# EAGLE schematic BusPirate-ultra.v1.0b (EAGLE 9.1.3)
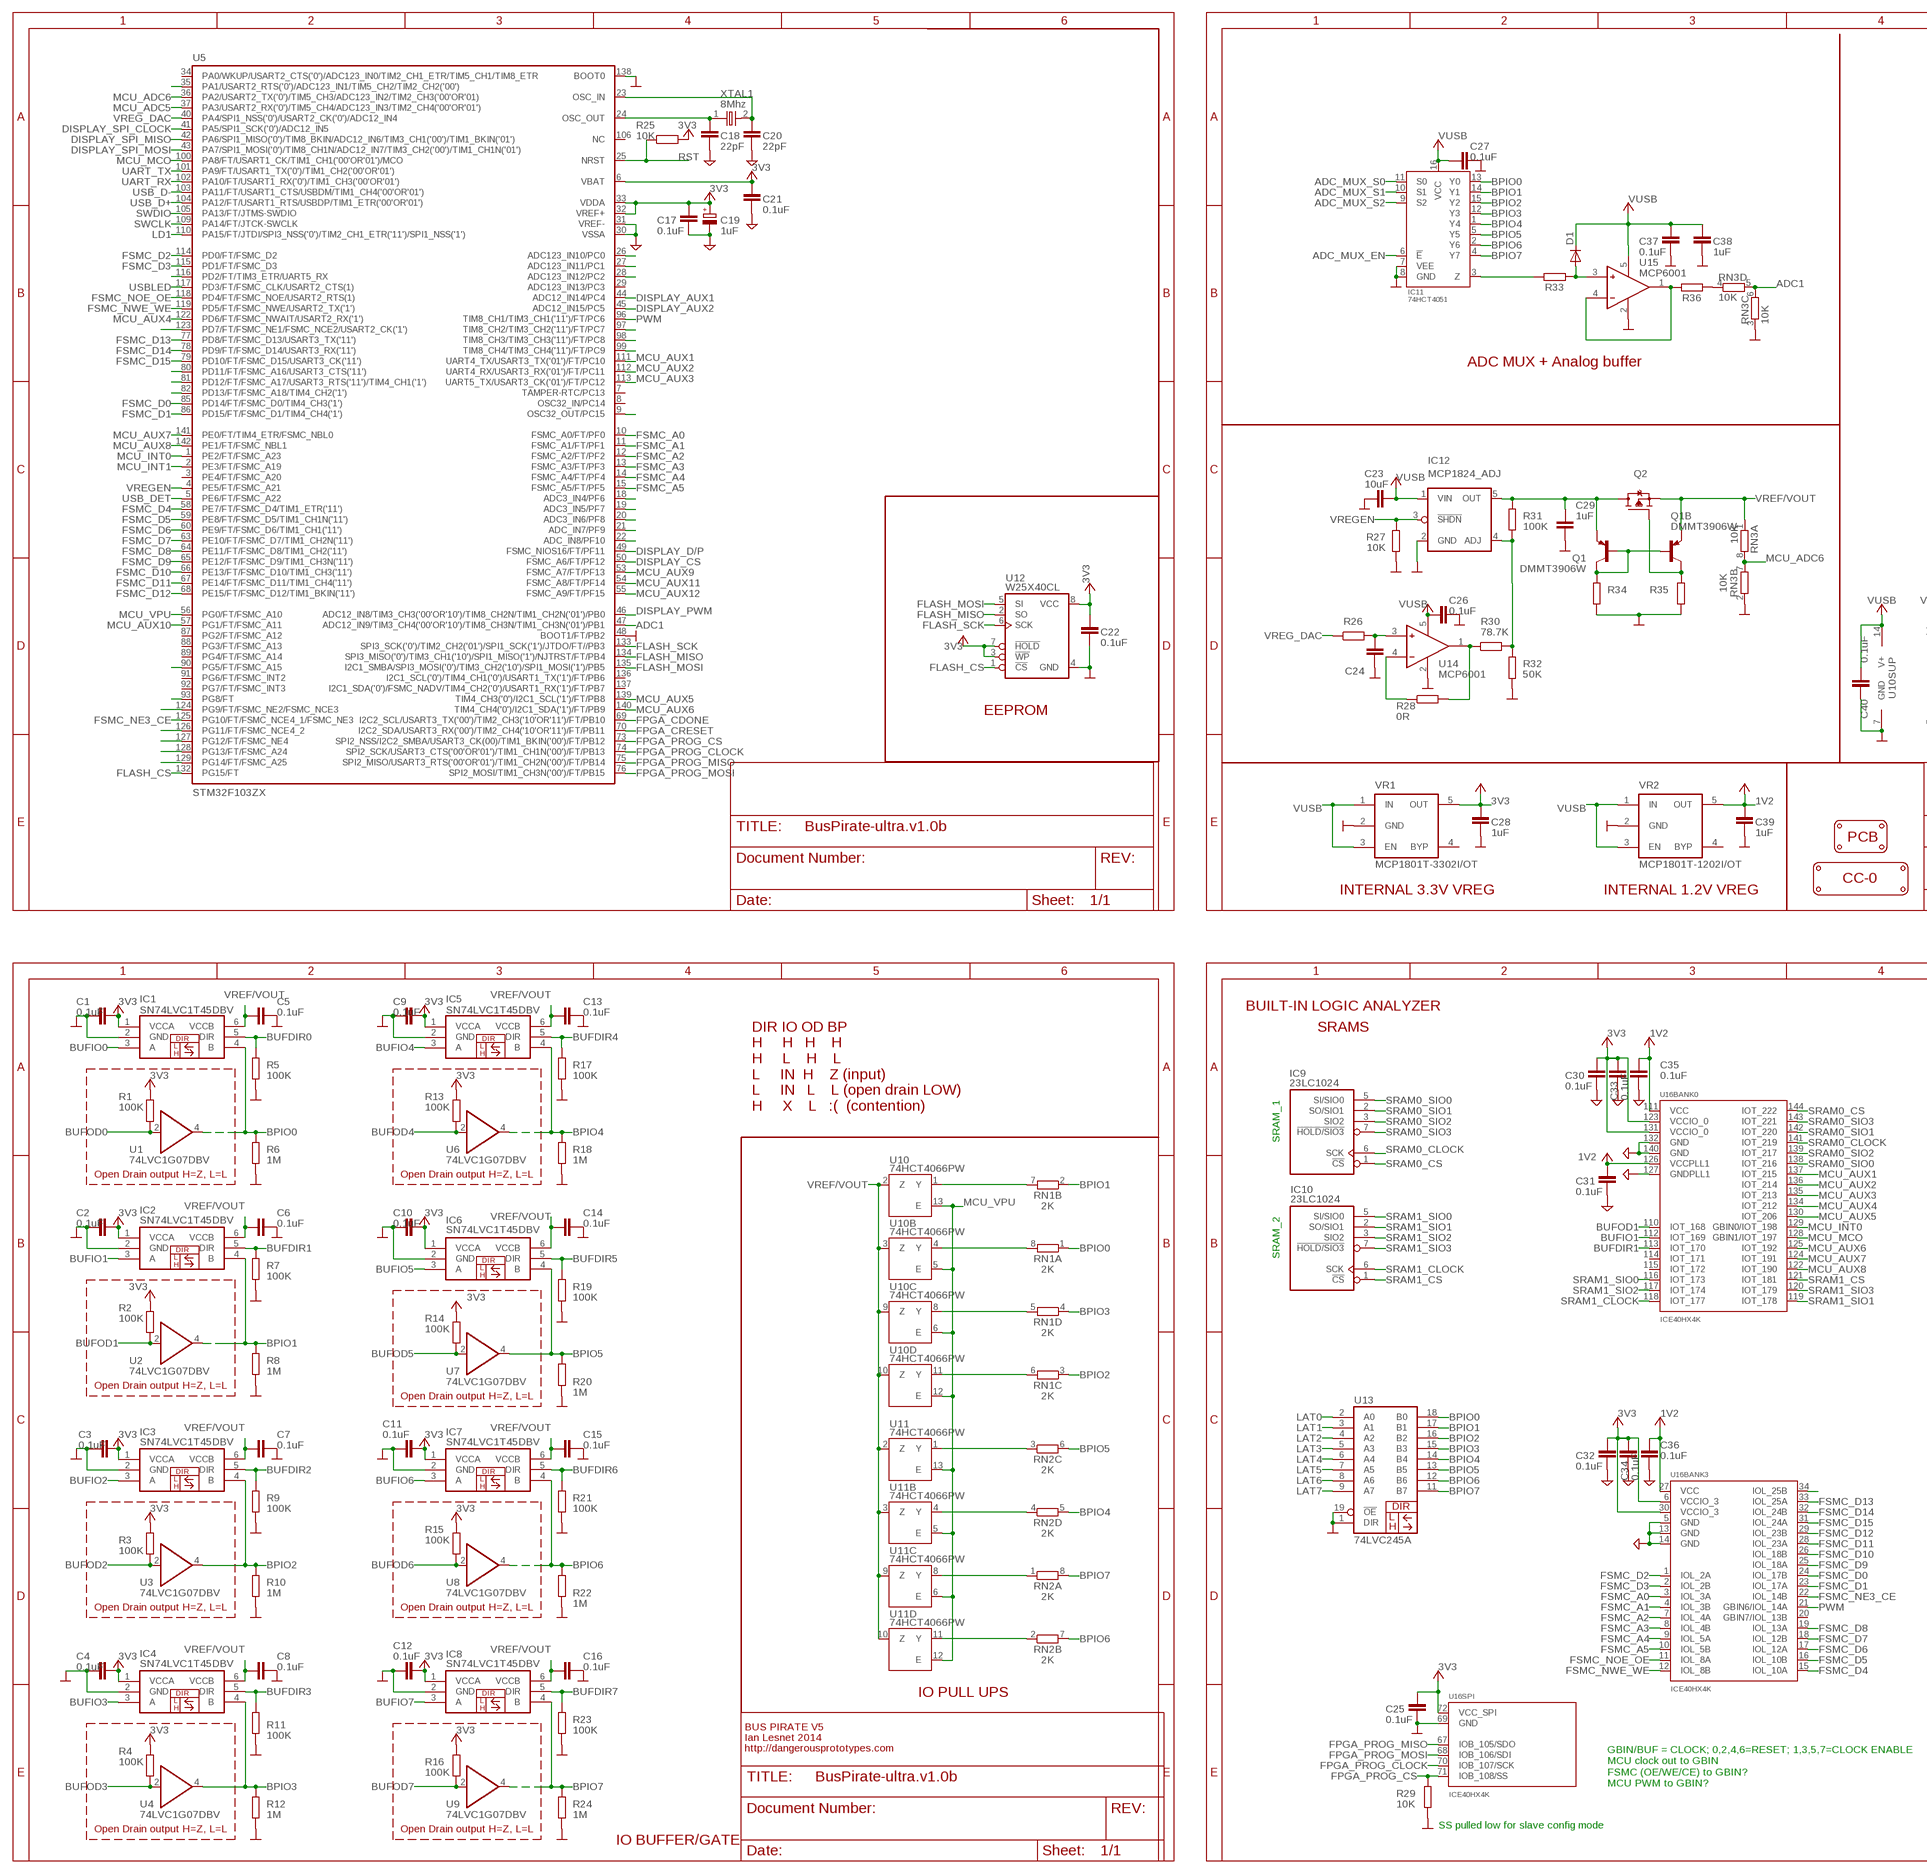
[diagram p0: schematic, sheet 1, part 1 of 2]
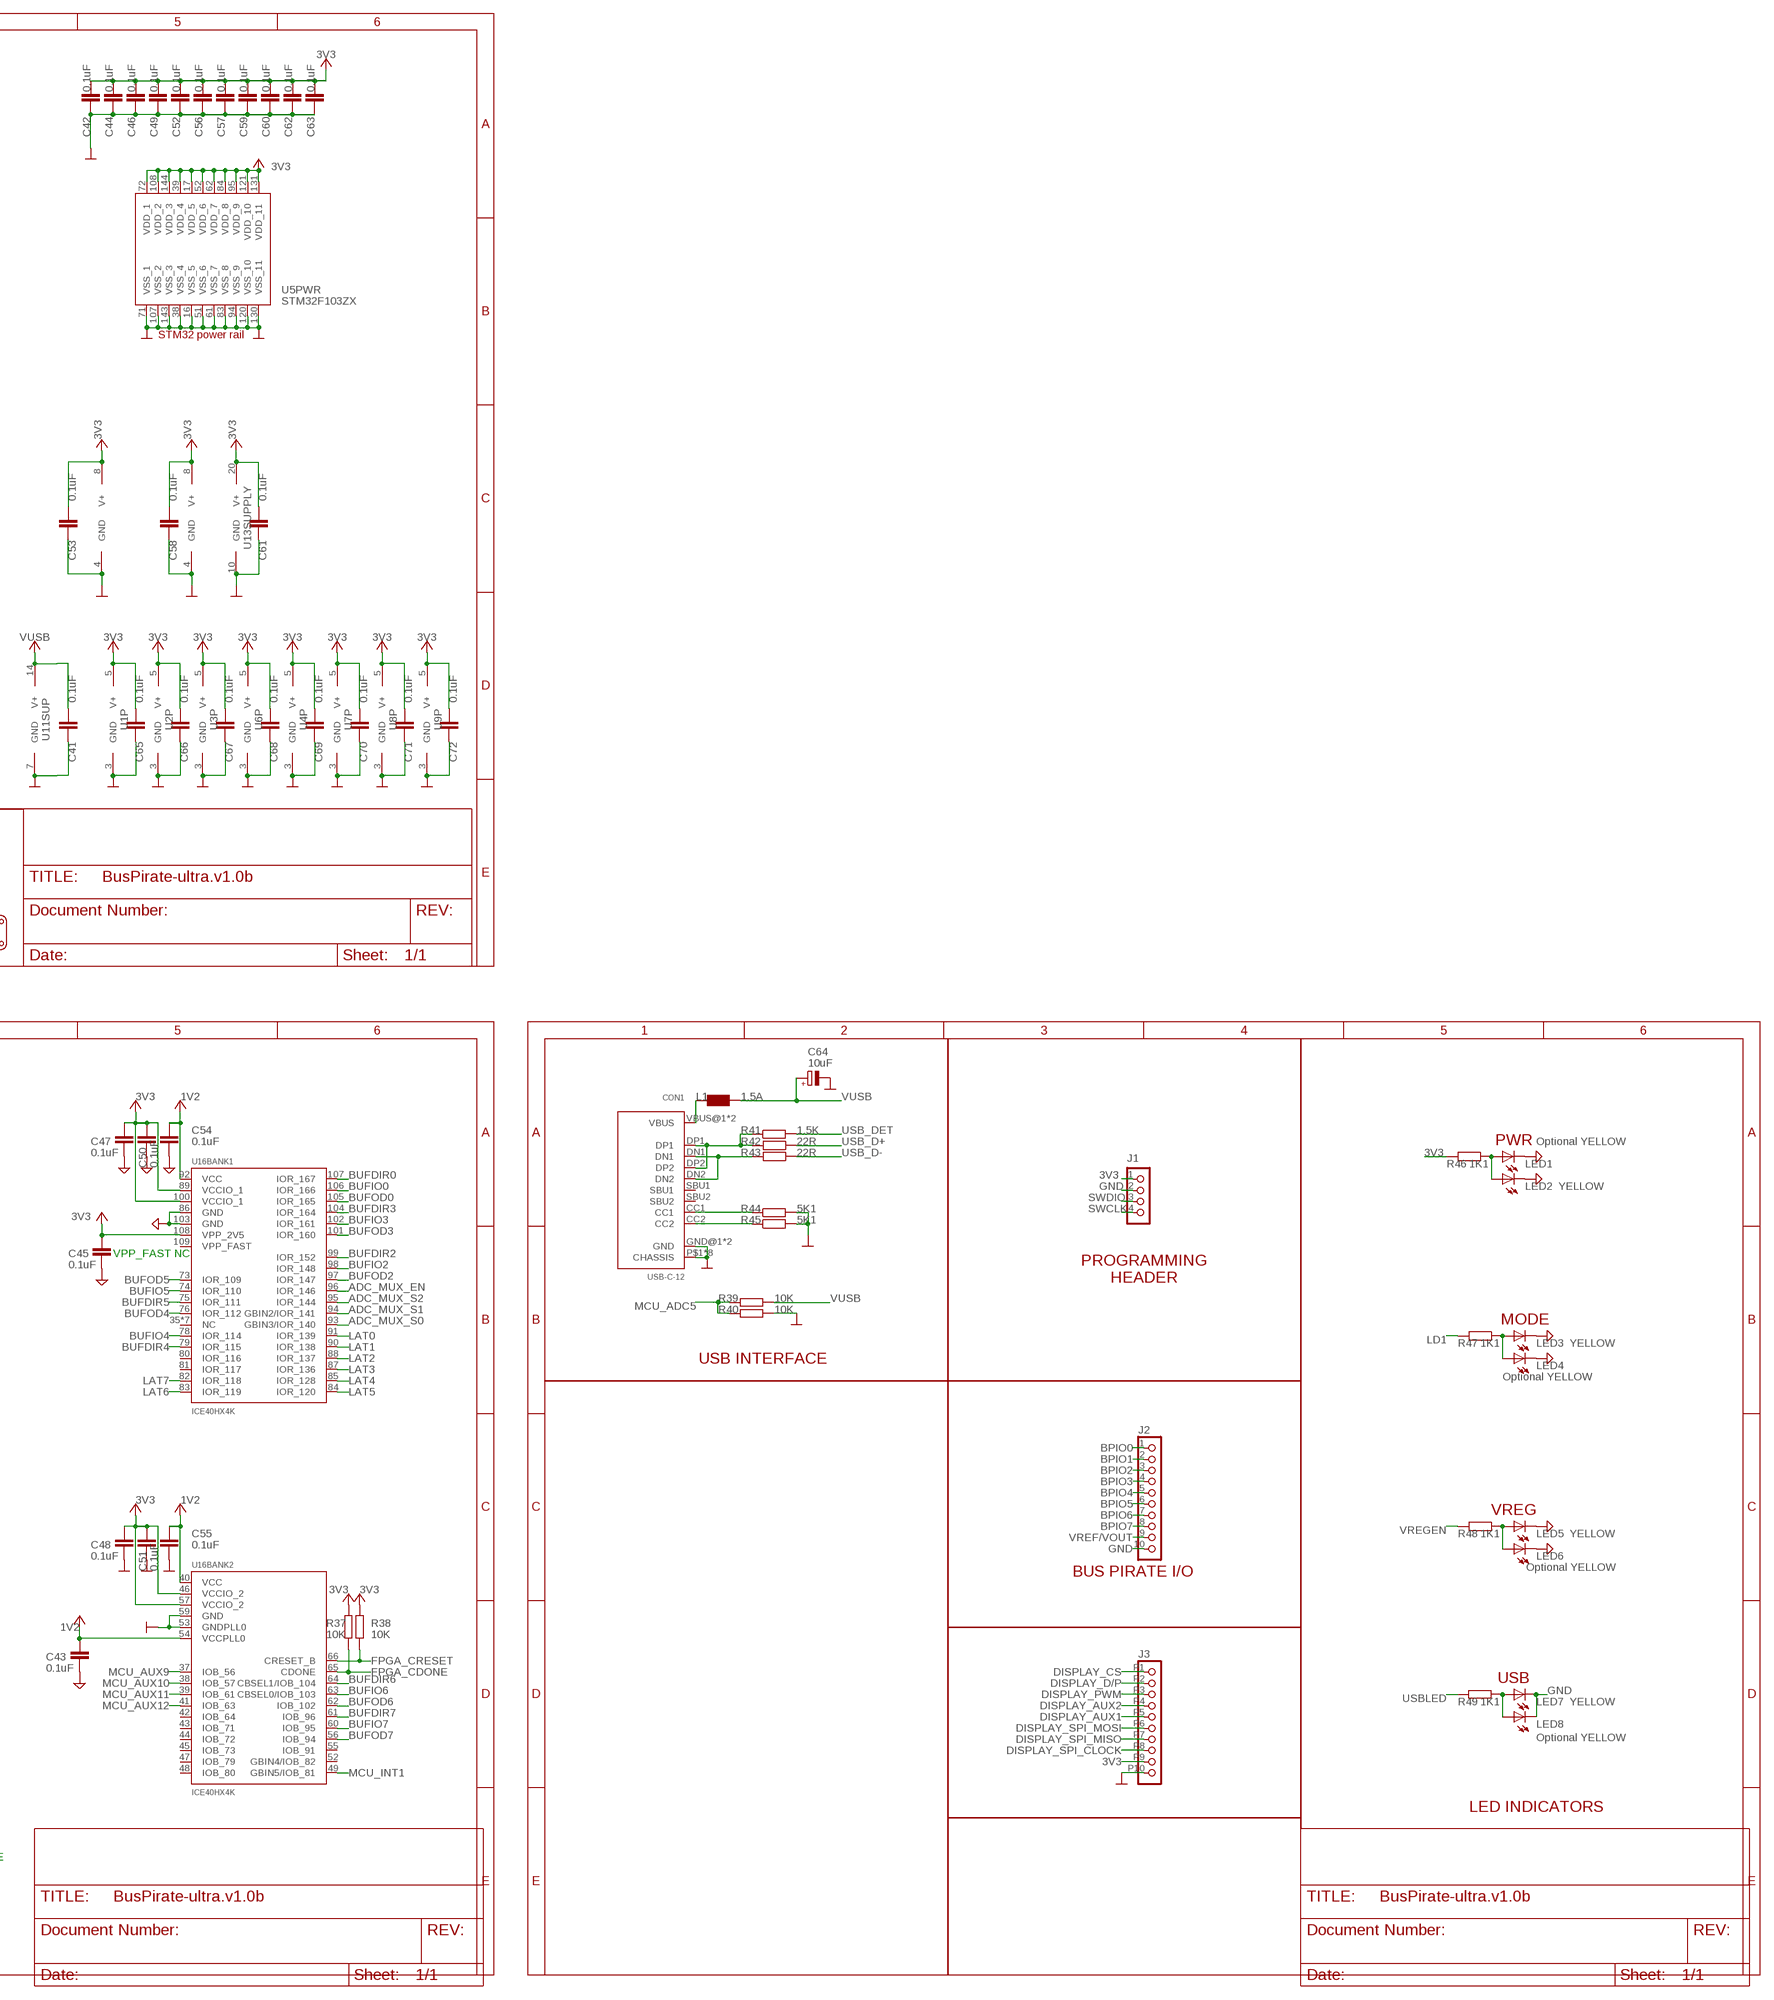
[diagram p1: schematic, sheet 1, part 2 of 2]

## Parts
C1  0.1uF  CAPACITOR_NPOL-0402  [C402]
C2  0.1uF  CAPACITOR_NPOL-0402  [C402]
C3  0.1uF  CAPACITOR_NPOL-0402  [C402]
C4  0.1uF  CAPACITOR_NPOL-0402  [C402]
C5  0.1uF  CAPACITOR_NPOL-0402  [C402]
C6  0.1uF  CAPACITOR_NPOL-0402  [C402]
C7  0.1uF  CAPACITOR_NPOL-0402  [C402]
C8  0.1uF  CAPACITOR_NPOL-0402  [C402]
C9  0.1uF  CAPACITOR_NPOL-0402  [C402]
C10  0.1uF  CAPACITOR_NPOL-0402  [C402]
C11  0.1uF  CAPACITOR_NPOL-0402  [C402]
C12  0.1uF  CAPACITOR_NPOL-0402  [C402]
C13  0.1uF  CAPACITOR_NPOL-0402  [C402]
C14  0.1uF  CAPACITOR_NPOL-0402  [C402]
C15  0.1uF  CAPACITOR_NPOL-0402  [C402]
C16  0.1uF  CAPACITOR_NPOL-0402  [C402]
C17  0.1uF  CAPACITOR_NPOL-0603  [C603]
C18  22pF  CAPACITOR_NPOL-0603  [C603]
C19  1uF  CAPACITOR_POL-SMC_A  [SMC_A]
C20  22pF  CAPACITOR_NPOL-0603  [C603]
C21  0.1uF  CAPACITOR_NPOL-0603  [C603]
C22  0.1uF  CAPACITOR_NPOL-0603  [C603]
C23  10uF  CAPACITOR_NPOL-0603  [C603]
C24  CAPACITOR_NPOL-0603  [C603]
C25  0.1uF  CAPACITOR_NPOL-0603  [C603]
C26  0.1uF  CAPACITOR_NPOL-0603  [C603]
C27  0.1uF  CAPACITOR_NPOL-0603  [C603]
C28  1uF  CAPACITOR_NPOL-0603  [C603]
C29  1uF  CAPACITOR_NPOL-0603  [C603]
C30  0.1uF  CAPACITOR_NPOL-0603  [C603]
C31  0.1uF  CAPACITOR_NPOL-0603  [C603]
C32  0.1uF  CAPACITOR_NPOL-0402  [C402]
C33  0.1uF  CAPACITOR_NPOL-0603  [C603]
C34  0.1uF  CAPACITOR_NPOL-0603  [C603]
C35  0.1uF  CAPACITOR_NPOL-0603  [C603]
C36  0.1uF  CAPACITOR_NPOL-0402  [C402]
C37  0.1uF  CAPACITOR_NPOL-0603  [C603]
C38  1uF  CAPACITOR_NPOL-0603  [C603]
C39  1uF  CAPACITOR_NPOL-0603  [C603]
C40  0.1uF  CAPACITOR_NPOL-0603  [C603]
C41  0.1uF  CAPACITOR_NPOL-0603  [C603]
C42  0.1uF  CAPACITOR_NPOL-0603  [C603]
C43  0.1uF  CAPACITOR_NPOL-0603  [C603]
C44  0.1uF  CAPACITOR_NPOL-0603  [C603]
C45  0.1uF  CAPACITOR_NPOL-0603  [C603]
C46  0.1uF  CAPACITOR_NPOL-0603  [C603]
C47  0.1uF  CAPACITOR_NPOL-0603  [C603]
C48  0.1uF  CAPACITOR_NPOL-0603  [C603]
C49  0.1uF  CAPACITOR_NPOL-0603  [C603]
C50  0.1uF  CAPACITOR_NPOL-0603  [C603]
C51  0.1uF  CAPACITOR_NPOL-0603  [C603]
C52  0.1uF  CAPACITOR_NPOL-0603  [C603]
C53  0.1uF  CAPACITOR_NPOL-0603  [C603]
C54  0.1uF  CAPACITOR_NPOL-0603  [C603]
C55  0.1uF  CAPACITOR_NPOL-0603  [C603]
C56  0.1uF  CAPACITOR_NPOL-0603  [C603]
C57  0.1uF  CAPACITOR_NPOL-0603  [C603]
C58  0.1uF  CAPACITOR_NPOL-0603  [C603]
C59  0.1uF  CAPACITOR_NPOL-0402  [C402]
C60  0.1uF  CAPACITOR_NPOL-0603  [C603]
C61  0.1uF  CAPACITOR_NPOL-0603  [C603]
C62  0.1uF  CAPACITOR_NPOL-0603  [C603]
C63  0.1uF  CAPACITOR_NPOL-0603  [C603]
C64  10uF  CAPACITOR_POL-SMC_A  [SMC_A]
C65  0.1uF  CAPACITOR_NPOL-0402  [C402]
C66  0.1uF  CAPACITOR_NPOL-0402  [C402]
C67  0.1uF  CAPACITOR_NPOL-0402  [C402]
C68  0.1uF  CAPACITOR_NPOL-0402  [C402]
C69  0.1uF  CAPACITOR_NPOL-0402  [C402]
C70  0.1uF  CAPACITOR_NPOL-0402  [C402]
C71  0.1uF  CAPACITOR_NPOL-0402  [C402]
C72  0.1uF  CAPACITOR_NPOL-0402  [C402]
CON1  USB-C-12  [C-31-M-12]
D1  DIODE-SOD-123  [SOD-123]
IC1  SN74LVC1T45DBV  IC_BUFF_SN74LVC1T45DBV-SC-70-6  [SC-70-6]
IC2  SN74LVC1T45DBV  IC_BUFF_SN74LVC1T45DBV-SC-70-6  [SC-70-6]
IC3  SN74LVC1T45DBV  IC_BUFF_SN74LVC1T45DBV-SC-70-6  [SC-70-6]
IC4  SN74LVC1T45DBV  IC_BUFF_SN74LVC1T45DBV-SC-70-6  [SC-70-6]
IC5  SN74LVC1T45DBV  IC_BUFF_SN74LVC1T45DBV-SC-70-6  [SC-70-6]
IC6  SN74LVC1T45DBV  IC_BUFF_SN74LVC1T45DBV-SC-70-6  [SC-70-6]
IC7  SN74LVC1T45DBV  IC_BUFF_SN74LVC1T45DBV-SC-70-6  [SC-70-6]
IC8  SN74LVC1T45DBV  IC_BUFF_SN74LVC1T45DBV-SC-70-6  [SC-70-6]
IC9  23LC1024  IC_MEM_23LC1024  [SOIC-8]
IC10  23LC1024  IC_MEM_23LC1024  [SOIC-8]
IC11  74HCT4051  IC_74HCT4051  [TSSOP-16]
IC12  MCP1824_ADJ  IC_MCP1824_ADJ  [SOT-23-5]
J1  CON_HEADER_1X04  [M1X4]
J2  CON_HEADER_1X10-RIGHT_ANGLED_PTH_SHROUDED  [M1X10_MALE_RIGHT_ANGLES_PTH_SHROUDED]
J3  CON_MOLEX_MALE_SMT_SH_1.25  [MOLEX_533980771]
L1  1.5A  WE-KIL_0805  [WE-KI_0805_B]
LED1  Optional YELLOW  LED-0805  [LED-805]
LED2  YELLOW  LED-0805  [LED-805]
LED3  YELLOW  LED-0805  [LED-805]
LED4  Optional YELLOW  LED-0805  [LED-805]
LED5  YELLOW  LED-0805  [LED-805]
LED6  Optional YELLOW  LED-0805  [LED-805]
LED7  YELLOW  LED-0805  [LED-805]
LED8  Optional YELLOW  LED-0805  [LED-805]
LOGO1  LOGO_CC-0  [LOGO_CC-0]
PCB1  PCB_DP_RECTANGLE-50X100  [DP10050_V1]
Q1  DMMT3906W  TRANSISTOR-BJT_DMMT3906W  [SOT-363]
Q2  TRANSISTOR_FET_TSM2301CX  [SOT-23]
R1  100K  RESISTOR-0402  [R402]
R2  100K  RESISTOR-0402  [R402]
R3  100K  RESISTOR-0402  [R402]
R4  100K  RESISTOR-0402  [R402]
R5  100K  RESISTOR-0402  [R402]
R6  1M  RESISTOR-0402  [R402]
R7  100K  RESISTOR-0402  [R402]
R8  1M  RESISTOR-0402  [R402]
R9  100K  RESISTOR-0402  [R402]
R10  1M  RESISTOR-0402  [R402]
R11  100K  RESISTOR-0402  [R402]
R12  1M  RESISTOR-0402  [R402]
R13  100K  RESISTOR-0402  [R402]
R14  100K  RESISTOR-0402  [R402]
R15  100K  RESISTOR-0402  [R402]
R16  100K  RESISTOR-0402  [R402]
R17  100K  RESISTOR-0402  [R402]
R18  1M  RESISTOR-0402  [R402]
R19  100K  RESISTOR-0402  [R402]
R20  1M  RESISTOR-0402  [R402]
R21  100K  RESISTOR-0402  [R402]
R22  1M  RESISTOR-0402  [R402]
R23  100K  RESISTOR-0402  [R402]
R24  1M  RESISTOR-0402  [R402]
R25  10K  RESISTOR-0603  [R603]
R26  RESISTOR-0603  [R603]
R27  10K  RESISTOR-0603  [R603]
R28  0R  RESISTOR-0603  [R603]
R29  10K  RESISTOR-0603  [R603]
R30  78.7K  RESISTOR-0603  [R603]
R31  100K  RESISTOR-0603  [R603]
R32  50K  RESISTOR-0603  [R603]
R33  RESISTOR-0603  [R603]
R34  RESISTOR-0603  [R603]
R35  RESISTOR-0603  [R603]
R36  RESISTOR-0603  [R603]
R37  10K  RESISTOR-0603  [R603]
R38  10K  RESISTOR-0603  [R603]
R39  10K  RESISTOR-0603  [R603]
R40  10K  RESISTOR-0603  [R603]
R41  1.5K  RESISTOR-0603  [R603]
R42  22R  RESISTOR-0603  [R603]
R43  22R  RESISTOR-0603  [R603]
R44  5K1  RESISTOR-0603  [R603]
R45  5K1  RESISTOR-0603  [R603]
R46  1K1  RESISTOR-0603  [R603]
R47  1K1  RESISTOR-0603  [R603]
R48  1K1  RESISTOR-0603  [R603]
R49  1K1  RESISTOR-0603  [R603]
RN1  2K  RNETWORK  [RN8P-4R-CRA06S]
RN2  2K  RNETWORK  [RN8P-4R-CRA06S]
RN3  10K  RNETWORK  [RN8P-4R-CRA06S]
U1  74LVC1G07DBV  IC_BUFF_74LVC1G07  [SC-70-5]
U2  74LVC1G07DBV  IC_BUFF_74LVC1G07  [SC-70-5]
U3  74LVC1G07DBV  IC_BUFF_74LVC1G07  [SC-70-5]
U4  74LVC1G07DBV  IC_BUFF_74LVC1G07  [SC-70-5]
U5  STM32F103ZX  IC_UC_STM32F103ZX  [TQFP-144]
U6  74LVC1G07DBV  IC_BUFF_74LVC1G07  [SC-70-5]
U7  74LVC1G07DBV  IC_BUFF_74LVC1G07  [SC-70-5]
U8  74LVC1G07DBV  IC_BUFF_74LVC1G07  [SC-70-5]
U9  74LVC1G07DBV  IC_BUFF_74LVC1G07  [SC-70-5]
U10  74HCT4066PW  IC_74HCT4066PW  [TSSOP-14]
U11  74HCT4066PW  IC_74HCT4066PW  [TSSOP-14]
U12  W25X40CL  IC_MEM_W25X40CL  [SOIC-8]
U13  74LVC245A  IC_BUFF_74LVC245A-TSSOP20  [TSSOP-20]
U14  MCP6001  IC_OP-AMP_MCP6001  [SOT-23-5]
U15  MCP6001  IC_MCP6001  [SOT-23-5]
U16  ICE40HX4K  IC_FPGA_ICE40HX4K  [TQFP-144]
VR1  MCP1801T-3302I/OT  MIC5205  [SOT-23-5@1]
VR2  MCP1801T-1202I/OT  MIC5205  [SOT-23-5@1]
XTAL1  8Mhz  OSC-XTAL-12M  [XTAL_4X6]

## Nets
1V2: C31.1 C35.1 C36.1 C39.2 C43.1 C54.1 C55.1 U16.27(BANK3:VCC) U16.40(BANK2:VCC) U16.54(BANK2:VCCPLL0) U16.92(BANK1:VCC) U16.111(BANK0:VCC) U16.126(BANK0:VCCPLL1) VR2.5(OUT) ; supply symbol labelled SUPPLY_+3V3
3V3: C1.2 C2.2 C3.2 C4.2 C9.2 C10.2 C11.2 C12.2 C17.1 C19.+ C21.1 C22.1 C25.1 C28.2 C30.1 C32.1 C33.1 C34.1 C42.1 C44.1 C45.1 C46.1 C47.1 C48.1 C49.1 C50.1 C51.1 C52.1 C53.2 C56.1 C57.1 C58.2 C59.1 C60.1 C61.2 C62.1 C63.1 C65.2 C66.2 C67.2 C68.2 C69.2 C70.2 C71.2 C72.2 IC1.1(VCCA) IC2.1(VCCA) IC3.1(VCCA) IC4.1(VCCA) IC5.1(VCCA) IC6.1(VCCA) IC7.1(VCCA) IC8.1(VCCA) IC9.8(V+) IC10.8(V+) J1.1 J3.P9 R1.2 R2.2 R3.2 R4.2 R13.2 R14.2 R15.2 R16.2 R25.2 R37.2 R38.2 R46.2 U1.5(V+) U2.5(V+) U3.5(V+) U4.5(V+) U5.6(VBAT) U5.17(VDD_5) U5.32(VREF+) U5.33(VDDA) U5.39(VDD_4) U5.52(VDD_6) U5.62(VDD_7) U5.72(VDD_1) U5.84(VDD_8) U5.95(VDD_9) U5.108(VDD_2) U5.121(VDD_10) U5.131(VDD_11) U5.144(VDD_3) U6.5(V+) U7.5(V+) U8.5(V+) U9.5(V+) U12.3(!WP) U12.7(!HOLD) U12.8(VCC) U13.20(V+) U16.6(BANK3:VCCIO_3) U16.30(BANK3:VCCIO_3) U16.46(BANK2:VCCIO_2) U16.57(BANK2:VCCIO_2) U16.72(SPI:VCC_SPI) U16.89(BANK1:VCCIO_1) U16.100(BANK1:VCCIO_1) U16.108(BANK1:VPP_2V5) U16.123(BANK0:VCCIO_0) U16.131(BANK0:VCCIO_0) VR1.5(OUT) ; supply symbol labelled V+, SUPPLY_+3V3, VCC
ADC1: RN3.5 RN3.6 U5.47(ADC12_IN9/TIM3_CH4('00'OR'10')/TIM8_CH3N/TIM1_CH3N('01')/PB1)
ADC_MUX_EN: IC11.6(!E) U16.96(BANK1:IOR_146)
ADC_MUX_S0: IC11.11(S0) U16.93(BANK1:GBIN3/IOR_140)
ADC_MUX_S1: IC11.10(S1) U16.94(BANK1:GBIN2/IOR_141)
ADC_MUX_S2: IC11.9(S2) U16.95(BANK1:IOR_144)
BPIO0: IC1.4(B) IC11.13(Y0) J2.1 R6.2 RN1.1 U1.4(O) U13.18(B0)
BPIO1: IC2.4(B) IC11.14(Y1) J2.2 R8.2 RN1.2 U2.4(O) U13.17(B1)
BPIO2: IC3.4(B) IC11.15(Y2) J2.3 R10.2 RN1.3 U3.4(O) U13.16(B2)
BPIO3: IC4.4(B) IC11.12(Y3) J2.4 R12.2 RN1.4 U4.4(O) U13.15(B3)
BPIO4: IC5.4(B) IC11.1(Y4) J2.5 R18.2 RN2.5 U6.4(O) U13.14(B4)
BPIO5: IC6.4(B) IC11.5(Y5) J2.6 R20.2 RN2.6 U7.4(O) U13.13(B5)
BPIO6: IC7.4(B) IC11.2(Y6) J2.7 R22.2 RN2.7 U8.4(O) U13.12(B6)
BPIO7: IC8.4(B) IC11.4(Y7) J2.8 R24.2 RN2.8 U9.4(O) U13.11(B7)
BUFDIR0: IC1.5(DIR) R5.2 U16.107(BANK1:IOR_167)
BUFDIR1: IC2.5(DIR) R7.2 U16.113(BANK0:IOT_170)
BUFDIR2: IC3.5(DIR) R9.2 U16.99(BANK1:IOR_152)
BUFDIR3: IC4.5(DIR) R11.2 U16.104(BANK1:IOR_164)
BUFDIR4: IC5.5(DIR) R17.2 U16.79(BANK1:IOR_115)
BUFDIR5: IC6.5(DIR) R19.2 U16.75(BANK1:IOR_111)
BUFDIR6: IC7.5(DIR) R21.2 U16.64(BANK2:CBSEL1/IOB_104)
BUFDIR7: IC8.5(DIR) R23.2 U16.61(BANK2:IOB_96)
BUFIO0: IC1.3(A) U16.106(BANK1:IOR_166)
BUFIO1: IC2.3(A) U16.112(BANK0:IOT_169)
BUFIO2: IC3.3(A) U16.98(BANK1:IOR_148)
BUFIO3: IC4.3(A) U16.102(BANK1:IOR_161)
BUFIO4: IC5.3(A) U16.78(BANK1:IOR_114)
BUFIO5: IC6.3(A) U16.74(BANK1:IOR_110)
BUFIO6: IC7.3(A) U16.63(BANK2:CBSEL0/IOB_103)
BUFIO7: IC8.3(A) U16.60(BANK2:IOB_95)
BUFOD0: R1.1 U1.2(I) U16.105(BANK1:IOR_165)
BUFOD1: R2.1 U2.2(I) U16.110(BANK0:IOT_168)
BUFOD2: R3.1 U3.2(I) U16.97(BANK1:IOR_147)
BUFOD3: R4.1 U4.2(I) U16.101(BANK1:IOR_160)
BUFOD4: R13.1 U6.2(I) U16.76(BANK1:IOR_112)
BUFOD5: R14.1 U7.2(I) U16.73(BANK1:IOR_109)
BUFOD6: R15.1 U8.2(I) U16.62(BANK2:IOB_102)
BUFOD7: R16.1 U9.2(I) U16.56(BANK2:IOB_94)
D+: CON1.DP1 CON1.DP2 R41.1 R42.2
D-: CON1.DN1 CON1.DN2 R43.2
DISPLAY_AUX1: J3.P5 U5.44(ADC12_IN14/PC4)
DISPLAY_AUX2: J3.P4 U5.45(ADC12_IN15/PC5)
DISPLAY_CS: J3.P1 U5.50(FSMC_A6/FT/PF12)
DISPLAY_D/P: J3.P2 U5.49(FSMC_NIOS16/FT/PF11)
DISPLAY_PWM: J3.P3 U5.46(ADC12_IN8/TIM3_CH3('00'OR'10')/TIM8_CH2N/TIM1_CH2N('01')/PB0)
DISPLAY_SPI_CLOCK: J3.P8 U5.41(PA5/SPI1_SCK('0')/ADC12_IN5)
DISPLAY_SPI_MISO: J3.P7 U5.42(PA6/SPI1_MISO('0')/TIM8_BKIN/ADC12_IN6/TIM3_CH1('00')/TIM1_BKIN('01'))
DISPLAY_SPI_MOSI: J3.P6 U5.43(PA7/SPI1_MOSI('0')/TIM8_CH1N/ADC12_IN7/TIM3_CH2('00')/TIM1_CH1N('01'))
FLASH_CS: U5.132(PG15/FT) U12.1(!CS)
FLASH_MISO: U5.134(SPI3_MISO('0')/TIM3_CH1('10')/SPI1_MISO('1')/NJTRST/FT/PB4) U12.2(SO)
FLASH_MOSI: U5.135(I2C1_SMBA/SPI3_MOSI('0')/TIM3_CH2('10')/SPI1_MOSI('1')/PB5) U12.5(SI)
FLASH_SCK: U5.133(SPI3_SCK('0')/TIM2_CH2('01')/SPI1_SCK('1')/JTDO/FT//PB3) U12.6(SCK)
FPGA_CDONE: R37.1 U5.69(I2C2_SCL/USART3_TX('00')/TIM2_CH3('10'OR'11')/FT/PB10) U16.65(BANK2:CDONE)
FPGA_CRESET: R38.1 U5.70(I2C2_SDA/USART3_RX('00')/TIM2_CH4('10'OR'11')/FT/PB11) U16.66(BANK2:CRESET_B)
FPGA_PROG_CLOCK: U5.74(SPI2_SCK/USART3_CTS('00'OR'01')/TIM1_CH1N('00')/FT/PB13) U16.70(SPI:IOB_107/SCK)
FPGA_PROG_CS: R29.2 U5.73(SPI2_NSS/I2C2_SMBA/USART3_CK(00)/TIM1_BKIN('00')/FT/PB12) U16.71(SPI:IOB_108/SS)
FPGA_PROG_MISO: U5.75(SPI2_MISO/USART3_RTS('00'OR'01')/TIM1_CH2N('00')/FT/PB14) U16.67(SPI:IOB_105/SDO)
FPGA_PROG_MOSI: U5.76(SPI2_MOSI/TIM1_CH3N('00')/FT/PB15) U16.68(SPI:IOB_106/SDI)
FSMC_A0: U5.10(FSMC_A0/FT/PF0) U16.3(BANK3:IOL_3A)
FSMC_A1: U5.11(FSMC_A1/FT/PF1) U16.4(BANK3:IOL_3B)
FSMC_A2: U5.12(FSMC_A2/FT/PF2) U16.7(BANK3:IOL_4A)
FSMC_A3: U5.13(FSMC_A3/FT/PF3) U16.8(BANK3:IOL_4B)
FSMC_A4: U5.14(FSMC_A4/FT/PF4) U16.9(BANK3:IOL_5A)
FSMC_A5: U5.15(FSMC_A5/FT/PF5) U16.10(BANK3:IOL_5B)
FSMC_D0: U5.85(PD14/FT/FSMC_D0/TIM4_CH3('1')) U16.24(BANK3:IOL_17B)
FSMC_D1: U5.86(PD15/FT/FSMC_D1/TIM4_CH4('1')) U16.23(BANK3:IOL_17A)
FSMC_D2: U5.114(PD0/FT/FSMC_D2) U16.1(BANK3:IOL_2A)
FSMC_D3: U5.115(PD1/FT/FSMC_D3) U16.2(BANK3:IOL_2B)
FSMC_D4: U5.58(PE7/FT/FSMC_D4/TIM1_ETR('11')) U16.15(BANK3:IOL_10A)
FSMC_D5: U5.59(PE8/FT/FSMC_D5/TIM1_CH1N('11')) U16.16(BANK3:IOL_10B)
FSMC_D6: U5.60(PE9/FT/FSMC_D6/TIM1_CH1('11')) U16.17(BANK3:IOL_12A)
FSMC_D7: U5.63(PE10/FT/FSMC_D7/TIM1_CH2N('11')) U16.18(BANK3:IOL_12B)
FSMC_D8: U5.64(PE11/FT/FSMC_D8/TIM1_CH2('11')) U16.19(BANK3:IOL_13A)
FSMC_D9: U5.65(PE12/FT/FSMC_D9/TIM1_CH3N('11')) U16.25(BANK3:IOL_18A)
FSMC_D10: U5.66(PE13/FT/FSMC_D10/TIM1_CH3('11')) U16.26(BANK3:IOL_18B)
FSMC_D11: U5.67(PE14/FT/FSMC_D11/TIM1_CH4('11')) U16.28(BANK3:IOL_23A)
FSMC_D12: U5.68(PE15/FT/FSMC_D12/TIM1_BKIN('11')) U16.29(BANK3:IOL_23B)
FSMC_D13: U5.77(PD8/FT/FSMC_D13/USART3_TX('11')) U16.33(BANK3:IOL_25A)
FSMC_D14: U5.78(PD9/FT/FSMC_D14/USART3_RX('11')) U16.32(BANK3:IOL_24B)
FSMC_D15: U5.79(PD10/FT/FSMC_D15/USART3_CK('11')) U16.31(BANK3:IOL_24A)
FSMC_NE3_CE: U5.125(PG10/FT/FSMC_NCE4_1/FSMC_NE3) U16.22(BANK3:IOL_14B)
FSMC_NOE_OE: U5.118(PD4/FT/FSMC_NOE/USART2_RTS(1)) U16.11(BANK3:IOL_8A)
FSMC_NWE_WE: U5.119(PD5/FT/FSMC_NWE/USART2_TX('1')) U16.12(BANK3:IOL_8B)
GND: C1.1 C2.1 C3.1 C4.1 C5.2 C6.2 C7.2 C8.2 C9.1 C10.1 C11.1 C12.1 C13.2 C14.2 C15.2 C16.2 C17.2 C18.2 C19.- C20.2 C21.2 C22.2 C23.2 C24.1 C25.2 C26.1 C27.1 C28.1 C29.2 C30.2 C31.2 C32.2 C33.2 C34.2 C35.2 C36.2 C37.2 C38.2 C39.1 C40.1 C41.1 C42.2 C43.2 C44.2 C45.2 C46.2 C47.2 C48.2 C49.2 C50.2 C51.2 C52.2 C53.1 C54.2 C55.2 C56.2 C57.2 C58.1 C59.2 C60.2 C61.1 C62.2 C63.2 C64.- C65.1 C66.1 C67.1 C68.1 C69.1 C70.1 C71.1 C72.1 CON1.GND@1(GND) CON1.GND@2(GND) CON1.P$1(CHASSIS) CON1.P$2(CHASSIS) CON1.P$3(CHASSIS) CON1.P$4(CHASSIS) CON1.P$5(CHASSIS) CON1.P$6(CHASSIS) CON1.P$7(CHASSIS) CON1.P$8(CHASSIS) IC1.2(GND) IC2.2(GND) IC3.2(GND) IC4.2(GND) IC5.2(GND) IC6.2(GND) IC7.2(GND) IC8.2(GND) IC9.4(GND) IC10.4(GND) IC11.7(VEE) IC11.8(GND) IC12.2(GND) J1.2 J2.10 J3.P10 LED1.C LED2.C LED3.C LED4.C LED5.C LED6.C LED7.C LED8.C R5.1 R6.1 R7.1 R8.1 R9.1 R10.1 R11.1 R12.1 R17.1 R18.1 R19.1 R20.1 R21.1 R22.1 R23.1 R24.1 R27.2 R29.1 R32.2 R34.1 R35.1 R40.1 R44.2 R45.2 RN3.2 RN3.3 U1.3(GND) U2.3(GND) U3.3(GND) U4.3(GND) U5.16(VSS_5) U5.30(VSSA) U5.31(VREF-) U5.38(VSS_4) U5.48(BOOT1/FT/PB2) U5.51(VSS_6) U5.61(VSS_7) U5.71(VSS_1) U5.83(VSS_8) U5.94(VSS_9) U5.107(VSS_2) U5.120(VSS_10) U5.130(VSS_11) U5.138(BOOT0) U5.143(VSS_3) U6.3(GND) U7.3(GND) U8.3(GND) U9.3(GND) U10.7(GND) U11.7(GND) U12.4(GND) U13.1(DIR) U13.10(GND) U13.19(!OE) U14.2(V-) U15.2(V-) U16.5(BANK3:GND) U16.13(BANK3:GND) U16.14(BANK3:GND) U16.53(BANK2:GNDPLL0) U16.59(BANK2:GND) U16.69(SPI:GND) U16.86(BANK1:GND) U16.103(BANK1:GND) U16.127(BANK0:GNDPLL1) U16.132(BANK0:GND) U16.140(BANK0:GND) VR1.2(GND) VR2.2(GND) ; supply symbol labelled SUPPLY_GND
LAT0: U13.2(A0) U16.91(BANK1:IOR_139)
LAT1: U13.3(A1) U16.90(BANK1:IOR_138)
LAT2: U13.4(A2) U16.88(BANK1:IOR_137)
LAT3: U13.5(A3) U16.87(BANK1:IOR_136)
LAT4: U13.6(A4) U16.85(BANK1:IOR_128)
LAT5: U13.7(A5) U16.84(BANK1:IOR_120)
LAT6: U13.8(A6) U16.83(BANK1:IOR_119)
LAT7: U13.9(A7) U16.82(BANK1:IOR_118)
LD1: R47.2 U5.110(PA15/FT/JTDI/SPI3_NSS('0')/TIM2_CH1_ETR('11')/SPI1_NSS('1'))
MCU_ADC5: R39.2 R40.2 U5.37(PA3/USART2_RX('0')/TIM5_CH4/ADC123_IN3/TIM2_CH4('00'OR'01'))
MCU_ADC6: RN3.7 RN3.8 U5.36(PA2/USART2_TX('0')/TIM5_CH3/ADC123_IN2/TIM2_CH3('00'OR'01))
MCU_AUX1: U5.111(UART4_TX/USART3_TX('01')/FT/PC10) U16.137(BANK0:IOT_215)
MCU_AUX2: U5.112(UART4_RX/USART3_RX('01')/FT/PC11) U16.136(BANK0:IOT_214)
MCU_AUX3: U5.113(UART5_TX/USART3_CK('01')/FT/PC12) U16.135(BANK0:IOT_213)
MCU_AUX4: U5.122(PD6/FT/FSMC_NWAIT/USART2_RX('1')) U16.134(BANK0:IOT_212)
MCU_AUX5: U5.139(TIM4_CH3('0')/I2C1_SCL('1')/FT/PB8) U16.130(BANK0:IOT_206)
MCU_AUX6: U5.140(TIM4_CH4('0')/I2C1_SDA('1')/FT/PB9) U16.125(BANK0:IOT_192)
MCU_AUX7: U5.141(PE0/FT/TIM4_ETR/FSMC_NBL0) U16.124(BANK0:IOT_191)
MCU_AUX8: U5.142(PE1/FT/FSMC_NBL1) U16.122(BANK0:IOT_190)
MCU_AUX9: U5.53(FSMC_A7/FT/PF13) U16.37(BANK2:IOB_56)
MCU_AUX10: U5.57(PG1/FT/FSMC_A11) U16.38(BANK2:IOB_57)
MCU_AUX11: U5.54(FSMC_A8/FT/PF14) U16.39(BANK2:IOB_61)
MCU_AUX12: U5.55(FSMC_A9/FT/PF15) U16.41(BANK2:IOB_63)
MCU_INT0: U5.1(PE2/FT/FSMC_A23) U16.129(BANK0:GBIN0/IOT_198)
MCU_INT1: U5.2(PE3/FT/FSMC_A19) U16.49(BANK2:GBIN5/IOB_81)
MCU_MCO: U5.100(PA8/FT/USART1_CK/TIM1_CH1('00'OR'01')/MCO) U16.128(BANK0:GBIN1/IOT_197)
MCU_VPU: U5.56(PG0/FT/FSMC_A10) U10.5(E) U10.6(E) U10.12(E) U10.13(E) U11.5(E) U11.6(E) U11.12(E) U11.13(E)
N$1: CON1.VBUS@1(VBUS) CON1.VBUS@2(VBUS) L1.2
N$2: RN1.7 U10.1(Y)
N$3: RN1.8 U10.4(Y)
N$4: RN1.5 U10.8(Y)
N$5: RN1.6 U10.11(Y)
N$6: LED3.A LED4.A R47.1
N$7: LED1.A LED2.A R46.1
N$8: C20.1 U5.23(OSC_IN) XTAL1.2
N$9: C18.1 U5.24(OSC_OUT) XTAL1.1
N$10: U5.35(PA1/USART2_RTS('0')/ADC123_IN1/TIM5_CH2/TIM2_CH2('00'))
N$11: Q1.6(C) Q2.1(G) R35.2
N$12: IC12.4(ADJ) R30.2 R31.1 R32.1
N$13: LED7.A LED8.A R49.1
N$14: CON1.CC1 R44.1
N$15: R28.1 U14.4(-)
N$16: U5.9(OSC32_OUT/PC15)
N$17: U16.34(BANK3:IOL_25B)
N$18: LED5.A LED6.A R48.1
N$19: U5.97(TIM8_CH2/TIM3_CH2('11')/FT/PC7)
N$20: CON1.CC2 R45.1
N$21: R36.2 RN3.4
N$22: U5.98(TIM8_CH3/TIM3_CH3('11')/FT/PC8)
N$23: U5.28(ADC123_IN12/PC2)
N$25: R28.2 R30.1 U14.1(OUT)
N$26: C29.1 IC12.5(OUT) Q1.4(E) Q2.3(D) R31.2
N$27: Q1.1(B) Q1.2(B) Q1.3(C) R34.2
N$28: U5.80(PD11/FT/FSMC_A16/USART3_CTS('11'))
N$29: U5.116(PD2/FT/TIM3_ETR/UART5_RX)
N$30: U5.26(ADC123_IN10/PC0)
N$31: C24.2 R26.2 U14.3(+)
N$32: D1.A R33.2 U15.3(+)
N$33: RN2.3 U11.1(Y)
N$34: U5.82(PD13/FT/FSMC_A18/TIM4_CH2('1'))
N$35: U5.27(ADC123_IN11/PC1)
N$36: U5.18(ADC3_IN4/PF6)
N$37: U5.19(ADC3_IN5/PF7)
N$38: U5.20(ADC3_IN6/PF8)
N$39: U5.21(ADC_IN7/PF9)
N$40: U5.22(ADC_IN8/PF10)
N$41: U5.99(TIM8_CH4/TIM3_CH4('11')/FT/PC9)
N$42: RN2.4 U11.4(Y)
N$43: U5.81(PD12/FT/FSMC_A17/USART3_RTS('11')/TIM4_CH1('1'))
N$44: RN2.1 U11.8(Y)
N$45: RN2.2 U11.11(Y)
N$52: U5.90(PG5/FT/FSMC_A15)
N$53: U5.93(PG8/FT)
N$54: U5.124(PG9/FT/FSMC_NE2/FSMC_NCE3)
N$56: U5.123(PD7/FT/FSMC_NE1/FSMC_NCE2/USART2_CK('1'))
N$57: U5.126(PG11/FT/FSMC_NCE4_2)
N$58: U5.127(PG12/FT/FSMC_NE4)
N$59: U5.128(PG13/FT/FSMC_A24)
N$60: U5.129(PG14/FT/FSMC_A25)
N$61: IC11.3(Z) R33.1
N$64: R36.1 U15.1(OUT) U15.4(-)
PWM: U5.96(TIM8_CH1/TIM3_CH1('11')/FT/PC6) U16.21(BANK3:GBIN6/IOL_14A)
RST: R25.1 U5.25(NRST)
SRAM0_CLOCK: IC9.6(SCK) U16.141(BANK0:IOT_219)
SRAM0_CS: IC9.1(!CS) U16.144(BANK0:IOT_222)
SRAM0_SIO0: IC9.5(SI/SIO0) U16.138(BANK0:IOT_216)
SRAM0_SIO1: IC9.2(SO/SIO1) U16.142(BANK0:IOT_220)
SRAM0_SIO2: IC9.3(SIO2) U16.139(BANK0:IOT_217)
SRAM0_SIO3: IC9.7(!HOLD/SIO3) U16.143(BANK0:IOT_221)
SRAM1_CLOCK: IC10.6(SCK) U16.118(BANK0:IOT_177)
SRAM1_CS: IC10.1(!CS) U16.121(BANK0:IOT_181)
SRAM1_SIO0: IC10.5(SI/SIO0) U16.116(BANK0:IOT_173)
SRAM1_SIO1: IC10.2(SO/SIO1) U16.119(BANK0:IOT_178)
SRAM1_SIO2: IC10.3(SIO2) U16.117(BANK0:IOT_174)
SRAM1_SIO3: IC10.7(!HOLD/SIO3) U16.120(BANK0:IOT_179)
SWCLK: J1.4 U5.109(PA14/FT/JTCK-SWCLK)
SWDIO: J1.3 U5.105(PA13/FT/JTMS-SWDIO)
UART_RX: U5.102(PA10/FT/USART1_RX('0')/TIM1_CH3('00'OR'01'))
UART_TX: U5.101(PA9/FT/USART1_TX('0')/TIM1_CH2('00'OR'01'))
USB_D+: R42.1 U5.104(PA12/FT/USART1_RTS/USBDP/TIM1_ETR('00'OR'01'))
USB_D-: R43.1 U5.103(PA11/FT/USART1_CTS/USBDM/TIM1_CH4('00'OR'01'))
USB_DET: R41.2 U5.5(PE6/FT/FSMC_A22)
USBLED: R49.2 U5.117(PD3/FT/FSMC_CLK/USART2_CTS(1))
VREF/VOUT: C5.1 C6.1 C7.1 C8.1 C13.1 C14.1 C15.1 C16.1 IC1.6(VCCB) IC2.6(VCCB) IC3.6(VCCB) IC4.6(VCCB) IC5.6(VCCB) IC6.6(VCCB) IC7.6(VCCB) IC8.6(VCCB) J2.9 Q1.5(E) Q2.2(S) RN3.1 U10.2(Z) U10.3(Z) U10.9(Z) U10.10(Z) U11.2(Z) U11.3(Z) U11.9(Z) U11.10(Z)
VREG_DAC: R26.1 U5.40(PA4/SPI1_NSS('0')/USART2_CK('0')/ADC12_IN4)
VREGEN: IC12.3(!SHDN) R27.1 R48.2 U5.4(PE5/FT/FSMC_A21)
VUSB: C23.1 C26.2 C27.2 C37.1 C38.1 C40.2 C41.2 C64.+ D1.C IC11.16(VCC) IC12.1(VIN) L1.1 R39.1 U10.14(V+) U11.14(V+) U14.5(V+) U15.5(V+) VR1.1(IN) VR1.3(EN) VR2.1(IN) VR2.3(EN) ; supply symbol labelled V+
Unconnected: CON1.SBU1 CON1.SBU2 U5.3(PE4/FT/FSMC_A20) U5.7(TAMPER-RTC/PC13) U5.8(OSC32_IN/PC14) U5.29(ADC123_IN13/PC3) U5.34(PA0/WKUP/USART2_CTS('0')/ADC123_IN0/TIM2_CH1_ETR/TIM5_CH1/TIM8_ETR) U5.87(PG2/FT/FSMC_A12) U5.88(PG3/FT/FSMC_A13) U5.89(PG4/FT/FSMC_A14) U5.91(PG6/FT/FSMC_INT2) U5.92(PG7/FT/FSMC_INT3) U5.106(NC) U5.136(I2C1_SCL('0')/TIM4_CH1('0')/USART1_TX('1')/FT/PB6) U5.137(I2C1_SDA('0')/FSMC_NADV/TIM4_CH2('0')/USART1_RX('1')/FT/PB7) U16.20(BANK3:GBIN7/IOL_13B) U16.35(BANK1:NC) U16.36(BANK1:NC) U16.42(BANK2:IOB_64) U16.43(BANK2:IOB_71) U16.44(BANK2:IOB_72) U16.45(BANK2:IOB_73) U16.47(BANK2:IOB_79) U16.48(BANK2:IOB_80) U16.50(BANK1:NC) U16.51(BANK1:NC) U16.52(BANK2:GBIN4/IOB_82) U16.55(BANK2:IOB_91) U16.58(BANK1:NC) U16.77(BANK1:NC) U16.80(BANK1:IOR_116) U16.81(BANK1:IOR_117) U16.114(BANK0:IOT_171) U16.115(BANK0:IOT_172) U16.133(BANK1:NC) VR1.4(BYP) VR2.4(BYP)

## Notes on the sheet
- STM32 power rail
- ADC MUX + Analog buffer
- EEPROM
- INTERNAL 3.3V VREG | INTERNAL 1.2V VREG
- BUILT-IN LOGIC ANALYZER
- SRAMS
- PWR
- DIR IO OD BP
  H     H   H    H
  H     L    H    L
  L     IN  H    Z (input)
  L     IN   L    L (open drain LOW)
  H     X    L   :(  (contention)
- SRAM_1
- Open Drain output H=Z, L=L | Open Drain output H=Z, L=L
- VPP_FAST NC
- PROGRAMMING
  HEADER
- MODE
- SRAM_2
- USB INTERFACE
- Open Drain output H=Z, L=L
- Open Drain output H=Z, L=L
- VREG
- BUS PIRATE I/O
- USB
- Open Drain output H=Z, L=L | Open Drain output H=Z, L=L
- IO PULL UPS
- LED INDICATORS
- BUS PIRATE V5
- Ian Lesnet 2014
- http://dangerousprototypes.com
- GBIN/BUF = CLOCK; 0,2,4,6=RESET; 1,3,5,7=CLOCK ENABLE
  MCU clock out to GBIN
  FSMC (OE/WE/CE) to GBIN?
  MCU PWM to GBIN?
- Open Drain output H=Z, L=L | Open Drain output H=Z, L=L | SS pulled low for slave config mode
- IO BUFFER/GATE

## Power pins joined to a net without a drawn wire
VPP_FAST: U16.109(BANK1:VPP_FAST)

## Library data of the parts
C1-C18 C20-C63 C65-C72 = dp_devices.v6:CAPACITOR_NPOL: Non-Polarized capacitor in various packages
C19 C64 = dp_devices.v6:CAPACITOR_POL: Polarized capacitor in various packages
CON1 = usbc:USB-C-12
D1 = dp_devices.v6:DIODE: Various Diode Packages
IC1-IC8 = dp_devices.v6:IC_BUFF_SN74LVC1T45DBV
IC9 IC10 = dp_devices:IC_MEM_23LC1024: 1Mbit SPI SRAM with Serial dual interface and Serial quad interface
IC11 = dp_devices.v6:IC_74HCT4051: 74HCT4051 8-channel analog mux/demux
IC12 = dp_devices.v6:IC_MCP1824_ADJ: MCP1824 ADJ 300mA, Low voltage, Low Quiescent current adjustable LDO regulator
J1 = dp_devices.v6:CON_HEADER_1X04
J2 = dp_devices.v6:CON_HEADER_1X10
J3 = dp_devices.v6:CON_MOLEX_MALE_SMT_SH_1.25: Molex 1.25mm PicoBlade Header vertical SMT 10 circuits p/n: 533980771
L1 = wuerth-elektronik:WE-KIL: SMD Wire Wound Ceramic Inductor WE-KIL - Low profile - High Q values -- Bluetooth -- Wireless LAN -- RF oscillation circuit -- IF impedance matching
LED1-LED8 = dp_devices.v6:LED: Light Emitting Diode
LOGO1 = dp_devices:LOGO_CC-0
PCB1 = dp_blank_pcb:PCB_DP_RECTANGLE: Dangerous Prototypes Standard Rectangular PCB sizes
Q1 = dp_devices.v6:TRANSISTOR-BJT_DMMT3906W: Matched pair PNP small signal transistor -40V -200mA
Q2 = dp_devices.v6:TRANSISTOR_FET_TSM2301CX: 20V P-Channel Enhancement Mode MOSFET
R1-R49 = dp_devices.v6:RESISTOR
RN1-RN3 = dp_devices:RNETWORK: 4 Resistor Array 0603
U1-U4 U6-U9 = dp_devices.v6:IC_BUFF_74LVC1G07: Single buffer/driver with open drain output
U5 = dp_devices.v6:IC_UC_STM32F103ZX: STM32F103ZX High-density performance line ARM based 32-bit MCU
U10 U11 = dp_devices.v6:IC_74HCT4066PW: Quad single-pole single-throw analog switch
U12 = dp_devices.v6:IC_MEM_W25X40CL: 4M-Bit serial flash memory with 4KB sectors and Dual I/O SPI
U13 = dp_devices.v6:IC_BUFF_74LVC245A: Octal Bus transceiver with 3-state, 3.3V supply
U14 = dp_devices.v6:IC_OP-AMP_MCP6001: 1 MHz, Low-Power Op Amp
U15 = dp_devices.v6:IC_MCP6001: 1 MHz, Low-Power Op Amp
U16 = dp_devices.v6:IC_FPGA_ICE40HX4K: iCE40HX4K iCE40™ HX ultra-low power, non-volatile FPGA
VR1 VR2 = dp_devices:MIC5205: 150ma Low-Noise LDO Regulator
XTAL1 = dp_devices.v6:OSC-XTAL